# Altium schematic sheet SWITCH.SchDoc: SWITCH
size A; SheetNumber: 2; SheetTotal: 7
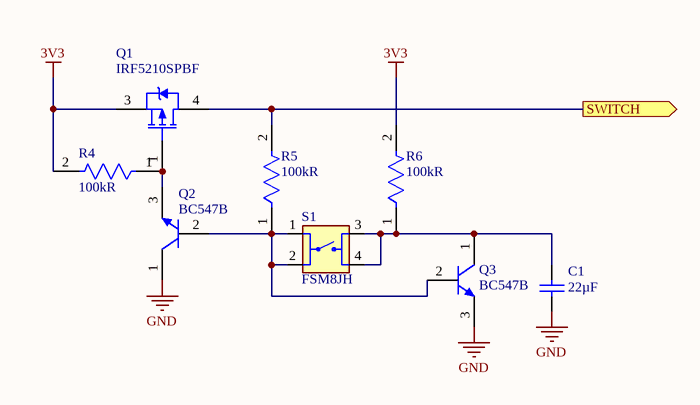
[diagram p0: SWITCH.SchDoc]

## Parts
C1  Capacitance: 22µF  [CAPC1608X100X20ML10]  (hidden comment: C1608X5R1A226M080AC)
Q1  IRF5210SPBF  [INTR-TO-263-3_L]
Q2  BC547B  [ONSC-TO-92-3-29-11]
Q3  BC547B  [ONSC-TO-92-3-29-11]
R4  Resistance: 100kR  [FP-RK73H1J-IPC_C]  (hidden comment: RK73H1JLTD1003F)
R5  Resistance: 100kR  [FP-RK73H1J-IPC_C]  (hidden comment: RK73H1JLTD1003F)
R6  Resistance: 100kR  [FP-RK73H1J-IPC_C]  (hidden comment: RK73H1JLTD1003F)
S1  FSM8JH  [SW_FSM8JH]

## Ports
SWITCH (out, see TOP[2B], HDMI[2B], HDMI_SWITCH[1C])

## Nets
3V3: Q1.3(SOURCE) R4.2 R6.2
GND: C1.1 Q2.1(C) Q3.3(E)
SWITCH: Q1.4(DRAIN) R5.2 ; port SWITCH
NetC1_2: C1.2 Q3.1(C) R6.1 S1.3 S1.4
NetQ1_1: Q1.1(GATE) Q2.3(E) R4.1
NetQ2_2: Q2.2(B) Q3.2(B) R5.1 S1.1 S1.2

## Library data of the parts
C1 = CMP-2000-05441-1: Chip Capacitor, 22 uF, +/- 20%, 10 V, -55 to 85 degC, 0603 (1608 Metric), RoHS, Tape and Reel; Manufacturer: TDK; PCN Part Number: MLCCPartNumberChange30/Nov/2012; Voltage - Rated: 10V; Product Training Modules: CSeriesGeneralApplicationsSEAT,CCV,andTVCLDesignToolsGuidetoReplacinganElectrolyticCapacitorwithanMLCC; Other Names: 445-9077-1; Design Resources: 20WNon-IsolatedBuckLEDDriverUsingPLLNK460KG; Online Catalog: CSeries,GeneralPurpose; Temperature Coefficient: X5R; Kits: 445-9014-KIT-ND-KITMLCC100PF-22UF060310-50V; Packaging: CutTape(CT); Standard Package: 1; Package / Case: 0603(1608Metric); Lead Style: -; Features: -; Ratings: -; Operating Temperature: -55degC~85degC; Applications: GeneralPurpose; Package Reference: 603; Datasheet URL: http://download.siliconexpert.com/pdfs/2015/4/21/15/54/45/779/tdk_/manual/37024850441143360mlcc_commercial_general_en.pdf; Datasheet Version: Mar-15; Mounting Type: SurfaceMount,MLCC; Lead Spacing: -; Size / Dimension: 0.063"Lx0.031"W(1.60mmx0.80mm); Height - Seated (Max): -; Package Description: 2-Pin Surface Mount Device, Body 1.6 x 0.8 mm; Manufacturer URL: http://www.tdk.com/; RoHS Information: RoHSCertificate-MLCC; Tolerance: ±20%; Series: C; Thickness (Max): 0.035"(0.90mm); Family: CeramicCapacitors; Category: Capacitors
Q1 = CMP-2000-06459-1: HEXFET(R) Power MOSFET, 3.1 W, 63 ns, -55 to 150 degC, 3-Pin DPAK (TO-263AB), RoHS, Tube; Manufacturer: International Rectifier; Drain-Source On Resistance-Max: 60mO; Rated Power Dissipation: 170W; Qg Gate Charge: 150nC; Channel Type: P-Channel; Drain-to-Source Voltage [Vdss]: 100V; Datasheet Version: 08/2009; Datasheet URL: https://datasheet.ciiva.com/15137/getdatasheetpartid-86705-15137623.pdf; Package Reference: TO-263-3; Package Description: 3-Pin Transistor Outline, Body 9.015 x 10.16 mm, Pitch 2.54 mm; Manufacturer URL: http://internationalrectifier.com/; Mounting Technology: SurfaceMount
Q2 Q3 = CMP-1048-01467-1: Amplifier Transistor, NPN Silicon, 3-Pin TO-92, Bulk Box; Manufacturer: On Semiconductor; IC Continuous (A): 0.1; fT Min (MHz): 150; DatasheetVersion: Rev. 7; ComponentLink1URL: http://www.onsemi.com/; Polarity: NPN; RoHS: FALSE; ComponentLink1Description: Manufacturer URL; Packing: Bulk Box; PackageDescription: 3-Pin Transistor Outline, Body 4.825 x 3.685 mm, Pitch 1.27 mm; ComponentLink3URL: http://www.onsemi.cn/pub_link/Collateral/2N6426-D.PDF; ComponentLink2Description: Datasheet; PackageVersion: Rev. AM; PackageReference: TO-92-3-29-11_AM_SL; ComponentLink3Description: Package Specification; Mounting Technology: Through Hole; PartNumber: BC547B; ComponentLink2URL: http://www.onsemi.com/pub_link/Collateral/BC546-D.PDF
R4-R6 = CMP-04015-074272-1: 100kΩ ±1% 0.1W Chip Resistor 0603 Thick Film AEC-Q200 Qualified; Temperature Coefficient: 100ppm/°C; Power Rating: 100mW; Voltage Rating: 50V; Series: RK73H; Case/Package: 0603; Max Operating Temperature: 155°C; Case Code (Imperial): 0603; Length: 1.6mm; Package Quantity: 5000; Min Operating Temperature: -55°C; Tolerance: 1%; Termination: SMD/SMT; Packaging: Tape and Reel; Case Code (Metric): 1608; Height: 0.45mm; Width: 0.8mm; Lead Free: Contains Lead
S1 = FSM8JH: Switch, Pushbutton, Tactile, SPST, Thru Hole, Vertical, 6MM, Black; Value: *; MP: FSM8JH; Package: None; Availability: Unavailable; Price: None